# Altium project Low_Level_ECU.PrjPcb (part 5 of 6)

## Sheet 12- BLE and FLASH.SchDoc: BLE AND SDCARD
size 420 x 297 mm; Revision: 1.0; SheetNumber: 12; SheetTotal: 13; Project: LOW LEVEL ECU
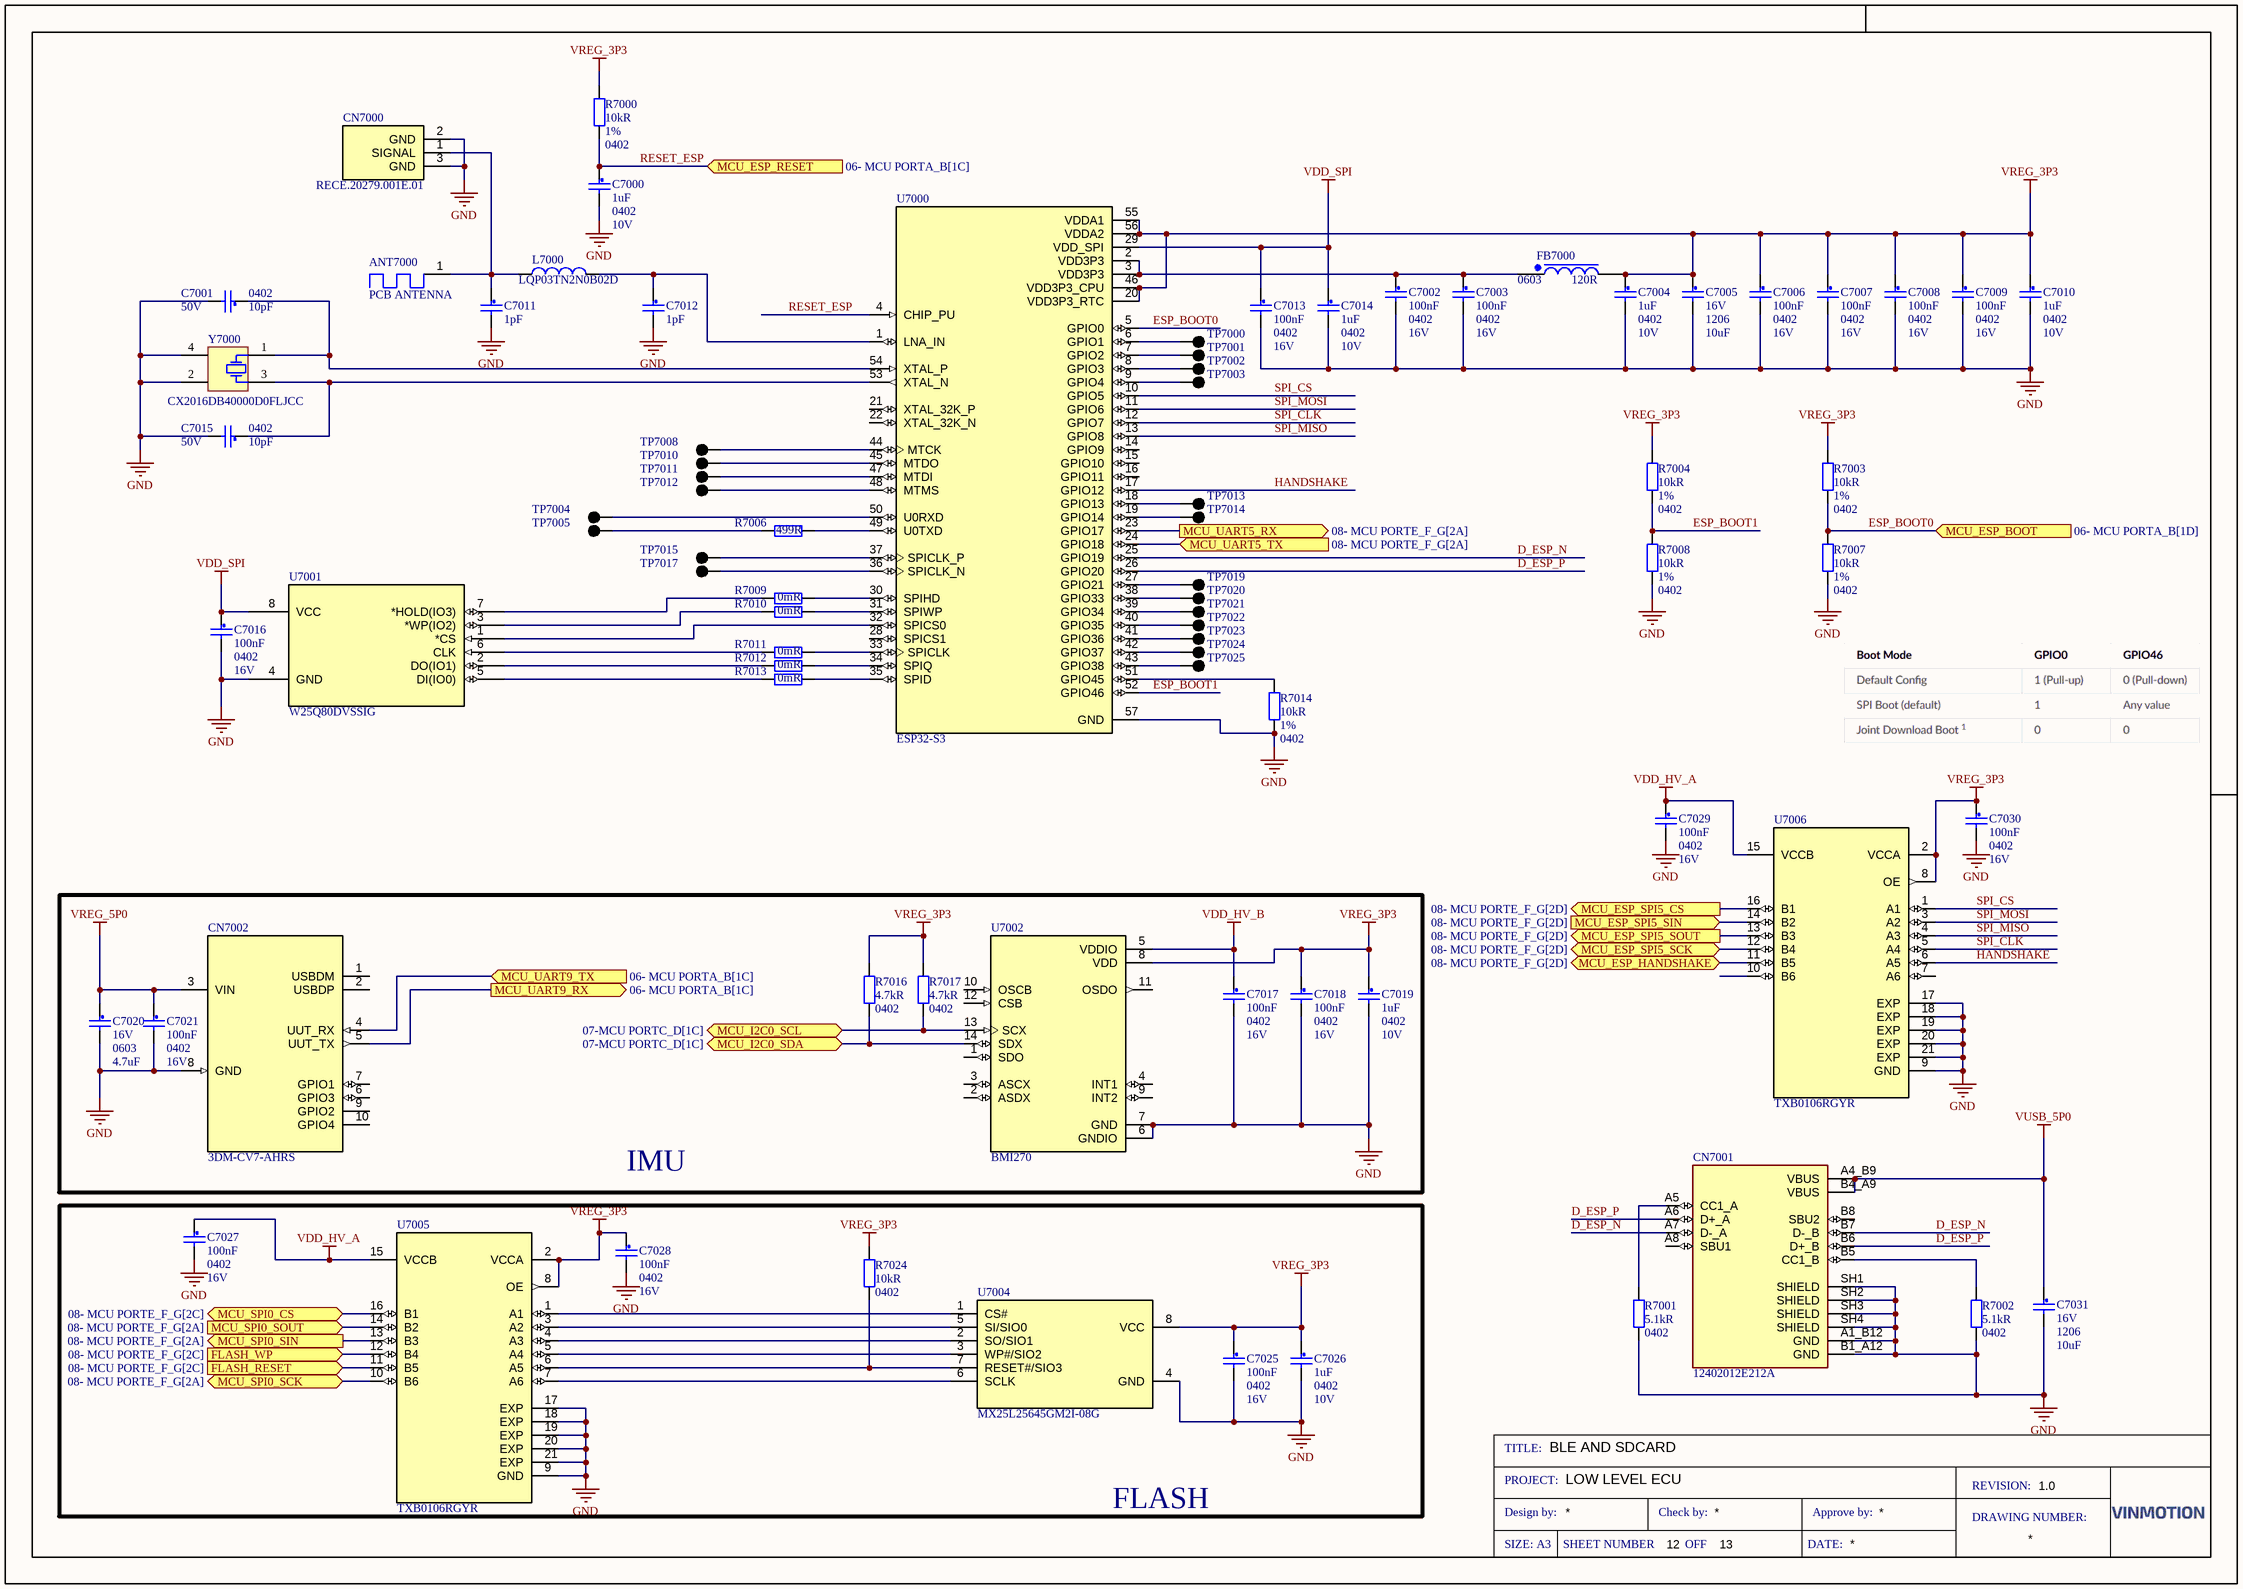
[diagram p10: 12- BLE and FLASH.SchDoc]

### Parts
ANT7000  PCB ANTENNA  [ANTENNA 2.4G]
C7000  value 1uF  Case/Package: 0402  Rated DC Voltage (URdc): 10V  [CAP0402]  (hidden comment: CL05X105KP5NNNC)
C7001  Voltage Rating: 50V  Case/Package: 0402  Capacitance: 10pF  [CAP0402]  (hidden comment: UMK105CG100DVHF)
C7002  Capacitance: 100nF  Case/Package: 0402  Voltage Rating (DC): 16V  [CAP0402]  (hidden comment: 0402YC104KAT2A)
C7003  Capacitance: 100nF  Case/Package: 0402  Voltage Rating (DC): 16V  [CAP0402]  (hidden comment: 0402YC104KAT2A)
C7004  value 1uF  Case/Package: 0402  Rated DC Voltage (URdc): 10V  [CAP0402]  (hidden comment: CL05X105KP5NNNC)
C7005  Voltage Rating: 16V  Case/Package: 1206  Capacitance: 10uF  [CAP1206]  (hidden comment: CL31B106KOHVPNE)
C7006  Capacitance: 100nF  Case/Package: 0402  Voltage Rating (DC): 16V  [CAP0402]  (hidden comment: 0402YC104KAT2A)
C7007  Capacitance: 100nF  Case/Package: 0402  Voltage Rating (DC): 16V  [CAP0402]  (hidden comment: 0402YC104KAT2A)
C7008  Capacitance: 100nF  Case/Package: 0402  Voltage Rating (DC): 16V  [CAP0402]  (hidden comment: 0402YC104KAT2A)
C7009  Capacitance: 100nF  Case/Package: 0402  Voltage Rating (DC): 16V  [CAP0402]  (hidden comment: 0402YC104KAT2A)
C7010  value 1uF  Case/Package: 0402  Rated DC Voltage (URdc): 10V  [CAP0402]  (hidden comment: CL05X105KP5NNNC)
C7011  value 1pF  [CAP0201]  (hidden comment: GRM0335C1H1R0BA01D)
C7012  value 1pF  [CAP0201]  (hidden comment: GRM0335C1H1R0BA01D)
C7013  Capacitance: 100nF  Case/Package: 0402  Voltage Rating (DC): 16V  [CAP0402]  (hidden comment: 0402YC104KAT2A)
C7014  value 1uF  Case/Package: 0402  Rated DC Voltage (URdc): 10V  [CAP0402]  (hidden comment: CL05X105KP5NNNC)
C7015  Voltage Rating: 50V  Case/Package: 0402  Capacitance: 10pF  [CAP0402]  (hidden comment: UMK105CG100DVHF)
C7016  Capacitance: 100nF  Case/Package: 0402  Voltage Rating (DC): 16V  [CAP0402]  (hidden comment: 0402YC104KAT2A)
C7017  Capacitance: 100nF  Case/Package: 0402  Voltage Rating (DC): 16V  [CAP0402]  (hidden comment: 0402YC104KAT2A)
C7018  Capacitance: 100nF  Case/Package: 0402  Voltage Rating (DC): 16V  [CAP0402]  (hidden comment: 0402YC104KAT2A)
C7019  value 1uF  Case/Package: 0402  Rated DC Voltage (URdc): 10V  [CAP0402]  (hidden comment: CL05X105KP5NNNC)
C7020  Voltage Rating: 16V  Case/Package: 0603  Capacitance: 4.7uF  [CAP0603]  (hidden comment: GRT188C81C475KE13D)
C7021  Capacitance: 100nF  Case/Package: 0402  Voltage Rating (DC): 16V  [CAP0402]  (hidden comment: 0402YC104KAT2A)
C7025  Capacitance: 100nF  Case/Package: 0402  Voltage Rating (DC): 16V  [CAP0402]  (hidden comment: 0402YC104KAT2A)
C7026  value 1uF  Case/Package: 0402  Rated DC Voltage (URdc): 10V  [CAP0402]  (hidden comment: CL05X105KP5NNNC)
C7027  Capacitance: 100nF  Case/Package: 0402  Voltage Rating (DC): 16V  [CAP0402]  (hidden comment: 0402YC104KAT2A)
C7028  Capacitance: 100nF  Case/Package: 0402  Voltage Rating (DC): 16V  [CAP0402]  (hidden comment: 0402YC104KAT2A)
C7029  Capacitance: 100nF  Case/Package: 0402  Voltage Rating (DC): 16V  [CAP0402]  (hidden comment: 0402YC104KAT2A)
C7030  Capacitance: 100nF  Case/Package: 0402  Voltage Rating (DC): 16V  [CAP0402]  (hidden comment: 0402YC104KAT2A)
C7031  Voltage Rating: 16V  Case/Package: 1206  Capacitance: 10uF  [CAP0603]  (hidden comment: CL31B106KOHVPNE)
CN7000  RECE.20279.001E.01  [IPEX CONNECTOR]
CN7001  12402012E212A  [USB_TYPE_C]
CN7002  3DM-CV7-AHRS  [3DM-CV7-AHRS]
FB7000  Case/Package: 0603  Impedance: 120R  [FB0603]  (hidden comment: BLM18KG121TH1D)
L7000  LQP03TN2N0B02D  [IND0201]
R7000  value 10kR  Tolerance: 1%  Case/Package: 0402  [RES0402]  (hidden comment: RMCF0402FT10K0)
R7001  Resistance: 5.1kR  Case/Package: 0402  [RES0402]  (hidden comment: MCR01MZPF5101)
R7002  Resistance: 5.1kR  Case/Package: 0402  [RES0402]  (hidden comment: MCR01MZPF5101)
R7003  value 10kR  Tolerance: 1%  Case/Package: 0402  [RES0402]  (hidden comment: RMCF0402FT10K0)
R7004  value 10kR  Tolerance: 1%  Case/Package: 0402  [RES0402]  (hidden comment: RMCF0402FT10K0)
R7006  value 499R  [RES0402]  (hidden comment: CRCW0402499RFKED)
R7007  value 10kR  Tolerance: 1%  Case/Package: 0402  [RES0402]  (hidden comment: RMCF0402FT10K0)
R7008  value 10kR  Tolerance: 1%  Case/Package: 0402  [RES0402]  (hidden comment: RMCF0402FT10K0)
R7009  Resistance: 0mR  [RES0402]  (hidden comment: RMCF0402ZT0R00)
R7010  Resistance: 0mR  [RES0402]  (hidden comment: RMCF0402ZT0R00)
R7011  Resistance: 0mR  [RES0402]  (hidden comment: RMCF0402ZT0R00)
R7012  Resistance: 0mR  [RES0402]  (hidden comment: RMCF0402ZT0R00)
R7013  Resistance: 0mR  [RES0402]  (hidden comment: RMCF0402ZT0R00)
R7014  value 10kR  Tolerance: 1%  Case/Package: 0402  [RES0402]  (hidden comment: RMCF0402FT10K0)
R7016  Resistance: 4.7kR  Case/Package: 0402  [RES0402]  (hidden comment: RMCF0402FT4K70)
R7017  Resistance: 4.7kR  Case/Package: 0402  [RES0402]  (hidden comment: RMCF0402FT4K70)
R7024  Resistance: 10kR  Case/Package: 0402  [RES0402]  (hidden comment: ERJ2GEJ103X)
TP7000  TP  [TP-SMD-R1]  (value not drawn)  (no BOM)
TP7001  TP  [TP-SMD-R1]  (value not drawn)  (no BOM)
TP7002  TP  [TP-SMD-R1]  (value not drawn)  (no BOM)
TP7003  TP  [TP-SMD-R1]  (value not drawn)  (no BOM)
TP7004  TP  [TP-SMD-R1]  (value not drawn)  (no BOM)
TP7005  TP  [TP-SMD-R1]  (value not drawn)  (no BOM)
TP7008  TP  [TP-SMD-R1]  (value not drawn)  (no BOM)
TP7010  TP  [TP-SMD-R1]  (value not drawn)  (no BOM)
TP7011  TP  [TP-SMD-R1]  (value not drawn)  (no BOM)
TP7012  TP  [TP-SMD-R1]  (value not drawn)  (no BOM)
TP7013  TP  [TP-SMD-R1]  (value not drawn)  (no BOM)
TP7014  TP  [TP-SMD-R1]  (value not drawn)  (no BOM)
TP7015  TP  [TP-SMD-R1]  (value not drawn)  (no BOM)
TP7017  TP  [TP-SMD-R1]  (value not drawn)  (no BOM)
TP7019  TP  [TP-SMD-R1]  (value not drawn)  (no BOM)
TP7020  TP  [TP-SMD-R1]  (value not drawn)  (no BOM)
TP7021  TP  [TP-SMD-R1]  (value not drawn)  (no BOM)
TP7022  TP  [TP-SMD-R1]  (value not drawn)  (no BOM)
TP7023  TP  [TP-SMD-R1]  (value not drawn)  (no BOM)
TP7024  TP  [TP-SMD-R1]  (value not drawn)  (no BOM)
TP7025  TP  [TP-SMD-R1]  (value not drawn)  (no BOM)
U7000  ESP32-S3  [56-VFQFN Exposed Pad]
U7001  W25Q80DVSSIG  [SOIC127P800X216-8N]
U7002  BMI270  [BIN270]
U7004  MX25L25645GM2I-08G  [SOIC127P800X175-8N]
U7005  TXB0106RGYR  [16-VFQFN Exposed Pad]
U7006  TXB0106RGYR  [16-VFQFN Exposed Pad]
Y7000  CX2016DB40000D0FLJCC  [CRYSTAL2016]

### Blocks framed on the sheet
IMU: C7017-C7021 CN7002 R7016 R7017 U7002
FLASH: C7025-C7028 R7024 U7004 U7005

### Ports
FLASH_RESET (in, see 08- MCU PORTE_F_G[2C]), FLASH_WP (in, see 08- MCU PORTE_F_G[2C]), MCU_ESP_BOOT (in, see 06- MCU PORTA_B[1D]), MCU_ESP_HANDSHAKE (bidir, see 08- MCU PORTE_F_G[2D]), MCU_ESP_RESET (in, see 06- MCU PORTA_B[1C]), MCU_ESP_SPI5_CS (out, see 08- MCU PORTE_F_G[2D]), MCU_ESP_SPI5_SCK (bidir, see 08- MCU PORTE_F_G[2D]), MCU_ESP_SPI5_SIN (in, see 08- MCU PORTE_F_G[2D]), MCU_ESP_SPI5_SOUT (out, see 08- MCU PORTE_F_G[2D]), MCU_I2C0_SCL (bidir, see 07-MCU PORTC_D[1C]), MCU_I2C0_SDA (bidir, see 07-MCU PORTC_D[1C]), MCU_SPI0_CS (bidir, see 08- MCU PORTE_F_G[2C]), MCU_SPI0_SCK (bidir, see 08- MCU PORTE_F_G[2A]), MCU_SPI0_SIN (out, see 08- MCU PORTE_F_G[2A]), MCU_SPI0_SOUT (in, see 08- MCU PORTE_F_G[2A]), MCU_UART5_RX (out, see 08- MCU PORTE_F_G[2A]), MCU_UART5_TX (in, see 08- MCU PORTE_F_G[2A]), MCU_UART9_RX (out, see 06- MCU PORTA_B[1C]), MCU_UART9_TX (in, see 06- MCU PORTA_B[1C])

### Nets
GND: C7000.2 C7001.2 C7002.2 C7003.2 C7004.2 C7005.2 C7006.2 C7007.2 C7008.2 C7009.2 C7010.2 C7011.2 C7012.2 C7013.2 C7014.2 C7015.2 C7016.2 C7017.2 C7018.2 C7019.2 C7020.2 C7021.2 C7025.2 C7026.2 C7027.2 C7028.2 C7029.2 C7030.2 C7031.2 CN7000.2(GND) CN7000.3(GND) CN7001.A1_B12(GND) CN7001.B1_A12(GND) CN7001.SH1(SHIELD) CN7001.SH2(SHIELD) CN7001.SH3(SHIELD) CN7001.SH4(SHIELD) CN7002.8(GND) R7001.1 R7002.1 R7007.1 R7008.1 R7014.1 U7000.57(GND) U7001.4(GND) U7002.6(GNDIO) U7002.7(GND) U7004.4(GND) U7005.9(GND) U7005.17(EXP) U7005.18(EXP) U7005.19(EXP) U7005.20(EXP) U7005.21(EXP) U7006.9(GND) U7006.17(EXP) U7006.18(EXP) U7006.19(EXP) U7006.20(EXP) U7006.21(EXP) Y7000.2(GND) Y7000.4(GND)
VDD_HV_A: C7027.1 C7029.1 U7005.15(VCCB) U7006.15(VCCB)
VDD_HV_B: C7017.1 U7002.5(VDDIO)
VDD_SPI: C7013.1 C7014.1 C7016.1 U7000.29(VDD_SPI) U7001.8(VCC)
VREG_3P3: C7004.1 C7005.1 C7006.1 C7007.1 C7008.1 C7009.1 C7010.1 C7018.1 C7019.1 C7025.1 C7026.1 C7028.1 C7030.1 FB7000.2 R7000.2 R7003.2 R7004.2 R7016.2 R7017.2 R7024.2 U7000.20(VDD3P3_RTC) U7000.46(VDD3P3_CPU) U7000.55(VDDA1) U7000.56(VDDA2) U7002.8(VDD) U7004.8(VCC) U7005.2(VCCA) U7005.8(OE) U7006.2(VCCA) U7006.8(OE)
VREG_5P0: C7020.1 C7021.1 CN7002.3(VIN)
VUSB_5P0: C7031.1 CN7001.A4_B9(VBUS) CN7001.B4_A9(VBUS)
D_ESP_N: CN7001.A7(D-_A) CN7001.B7(D-_B) U7000.25(GPIO19)
D_ESP_P: CN7001.A6(D+_A) CN7001.B6(D+_B) U7000.26(GPIO20)
ESP_BOOT0: R7003.1 R7007.2 U7000.5(GPIO0) ; port MCU_ESP_BOOT
ESP_BOOT1: R7004.1 R7008.2 U7000.52(GPIO46)
HANDSHAKE: U7000.17(GPIO12) U7006.6(A5)
RESET_ESP: C7000.1 R7000.1 U7000.4(CHIP_PU) ; port MCU_ESP_RESET
SPI_CLK: U7000.12(GPIO7) U7006.5(A4)
SPI_CS: U7000.10(GPIO5) U7006.1(A1)
SPI_MISO: U7000.13(GPIO8) U7006.4(A3)
SPI_MOSI: U7000.11(GPIO6) U7006.3(A2)
NetANT7000_1: ANT7000.1(ANT) C7011.1 CN7000.1(SIGNAL) L7000.1
NetC7001_1: C7001.1 U7000.54(XTAL_P) Y7000.1(OSC1)
NetC7002_1: C7002.1 C7003.1 FB7000.1 U7000.2(VDD3P3) U7000.3(VDD3P3)
NetC7012_1: C7012.1 L7000.2 U7000.1(LNA_IN)
NetC7015_1: C7015.1 U7000.53(XTAL_N) Y7000.3(OSC2)
NetCN7001_A5: CN7001.A5(CC1_A) R7001.2
NetCN7001_B5: CN7001.B5(CC1_B) R7002.2
NetCN7002_4: CN7002.4(UUT_RX) ; port MCU_UART9_TX
NetCN7002_5: CN7002.5(UUT_TX) ; port MCU_UART9_RX
NetR7006_1: R7006.1 U7000.49(U0TXD)
NetR7006_2: R7006.2 TP7005.1
NetR7009_1: R7009.1 U7001.7(*HOLD(IO3))
NetR7009_2: R7009.2 U7000.30(SPIHD)
NetR7010_1: R7010.1 U7001.3(*WP(IO2))
NetR7010_2: R7010.2 U7000.31(SPIWP)
NetR7011_1: R7011.1 U7001.6(CLK)
NetR7011_2: R7011.2 U7000.33(SPICLK)
NetR7012_1: R7012.1 U7001.2(DO(IO1))
NetR7012_2: R7012.2 U7000.34(SPIQ)
NetR7013_1: R7013.1 U7001.5(DI(IO0))
NetR7013_2: R7013.2 U7000.35(SPID)
NetR7014_2: R7014.2 U7000.51(GPIO45)
NetR7016_1: R7016.1 U7002.14(SDX) ; port MCU_I2C0_SDA
NetR7017_1: R7017.1 U7002.13(SCX) ; port MCU_I2C0_SCL
NetR7024_1: R7024.1 U7004.7(RESET#/SIO3) U7005.6(A5)
NetTP7000_1: TP7000.1 U7000.6(GPIO1)
NetTP7001_1: TP7001.1 U7000.7(GPIO2)
NetTP7002_1: TP7002.1 U7000.8(GPIO3)
NetTP7003_1: TP7003.1 U7000.9(GPIO4)
NetTP7004_1: TP7004.1 U7000.50(U0RXD)
NetTP7008_1: TP7008.1 U7000.44(MTCK)
NetTP7010_1: TP7010.1 U7000.45(MTDO)
NetTP7011_1: TP7011.1 U7000.47(MTDI)
NetTP7012_1: TP7012.1 U7000.48(MTMS)
NetTP7013_1: TP7013.1 U7000.18(GPIO13)
NetTP7014_1: TP7014.1 U7000.19(GPIO14)
NetTP7015_1: TP7015.1 U7000.37(SPICLK_P)
NetTP7017_1: TP7017.1 U7000.36(SPICLK_N)
NetTP7019_1: TP7019.1 U7000.27(GPIO21)
NetTP7020_1: TP7020.1 U7000.38(GPIO33)
NetTP7021_1: TP7021.1 U7000.39(GPIO34)
NetTP7022_1: TP7022.1 U7000.40(GPIO35)
NetTP7023_1: TP7023.1 U7000.41(GPIO36)
NetTP7024_1: TP7024.1 U7000.42(GPIO37)
NetTP7025_1: TP7025.1 U7000.43(GPIO38)
NetU3000_A5: U7005.10(B6) ; port MCU_SPI0_SCK
NetU3000_B5: U7005.13(B3) ; port MCU_SPI0_SIN
NetU3000_B10: U7005.14(B2) ; port MCU_SPI0_SOUT
NetU3000_E6: U7006.12(B4) ; port MCU_ESP_SPI5_SCK
NetU3000_F5: U7006.13(B3) ; port MCU_ESP_SPI5_SOUT
NetU3000_F10: U7006.11(B5) ; port MCU_ESP_HANDSHAKE
NetU3000_G5: U7006.14(B2) ; port MCU_ESP_SPI5_SIN
NetU3000_H5: U7006.16(B1) ; port MCU_ESP_SPI5_CS
NetU3000_L3: U7000.24(GPIO18) ; port MCU_UART5_TX
NetU3000_L10: U7005.16(B1) ; port MCU_SPI0_CS
NetU3000_N1: U7000.23(GPIO17) ; port MCU_UART5_RX
NetU3000_P13: U7005.11(B5) ; port FLASH_RESET
NetU3000_R12: U7005.12(B4) ; port FLASH_WP
NetU7000_32: U7000.32(SPICS0) U7001.1(*CS)
NetU7004_1: U7004.1(CS#) U7005.1(A1)
NetU7004_2: U7004.2(SO/SIO1) U7005.4(A3)
NetU7004_3: U7004.3(WP#/SIO2) U7005.5(A4)
NetU7004_5: U7004.5(SI/SIO0) U7005.3(A2)
NetU7004_6: U7004.6(SCLK) U7005.7(A6)

Not connected (* = marked no-connect by the designer): CN7001 A8(SBU1) B8(SBU2); CN7002 1(USBDM) 2(USBDP) 6(GPIO3) 7(GPIO1) 9(GPIO2) 10(GPIO4); U7000 14(GPIO9) 15(GPIO10) 16(GPIO11) 21(XTAL_32K_P) 22(XTAL_32K_N) 28(SPICS1); U7002 1(SDO) 2(ASDX) 3(ASCX) 4(INT1) 9(INT2) 10(OSCB) 11(OSDO) 12(CSB); U7006 7(A6) 10(B6)

### Notes on the sheet
- TITLE:
- PROJECT:
- Design by:
- Check by:
- Approve by:
- DRAWING NUMBER:
- REVISION:
- SIZE: A3
- SHEET NUMBER
- OFF
- DATE:

### Library data of the parts
ANT7000 = CMP-01139-1: PCB ANTENNA 2.4G
C7000 C7004 C7010 C7014 C7019 C7026 = CMP-01106-1: CAP CER 1UF 10V X6S 0402; Manufacturer: Samsung; Capacitor Type: Ceramic; Multilayer: Yes; Tolerance  (fill in as +-): 10%; Max Operating Temperature: 105°C; Category: Ceramic Capacitors; Dielectric Material: Ceramic; Height: 0.55mm; JESD-609 Code: e3; Length: 1mm; Manufacturer Part Number: CL05X105KP5NNNC; Min Operating Temperature: -55°C; Mounting Technology: Surface Mount; Pins: 2; Package Shape: Rectangular; Package Style: SMTMeter; Packaging: Tape and Reel; Tolerance (fill in as +-): 10%; Reach SVHC Compliant: Yes; RoHS Compliant: Yes; Temperature Characteristics Code: X6S; Terminal Finish: Nickel; Termination: Wraparound; Width: 0.5mm
C7001 C7015 = CMP-00047-2: CAP CER 10pF 50V NP0 0402; Manufacturer 1: Taiyo Yuden; Mount Type(SMD/TH): SMD; Crossable(YES/NO): YES; Manufacturer Part Number 1: UMK105CG100DVHF; Mount: Surface Mount; Case Code (Metric): 1005; Max Operating Temperature: 125°C; Thickness: 0.022inch; Min Operating Temperature: -55°C; Case Code (Imperial): 0402; Width: 0.02inch; Ratings: AEC-Q200; Length: 0.039inch; Packaging: Tape and Reel; Lead Free: Lead Free; Voltage Rating (DC): 50V; Halogen Free: Halogen Free; Height: 0.5mm
C7002 C7003 C7006-C7009 C7013 C7016-C7018 C7021 C7025 C7027-C7030 = CMP-00988-1: CAP CER 0.1UF 16V X7R 0402; Manufacturer 1: KYOCERA AVX; Crossable(YES/NO): YES; Mount Type(SMD/TH): SMD; Case Code (Imperial): 0402; Case Code (Metric): 1005; Dielectric: X7R; Manufacturer Part Number 1: 0402YC104KAT2A; Max Operating Temperature: 125°C; Min Operating Temperature: -55°C; Mount: Surface Mount; Voltage Rating: 16V
C7005 C7031 = CMP-00045-5: CAP CER 10uF 16V 10% X7R 1206 SMD; Manufacturer 1: Samsung; Crossable(YES/NO): YES; Ratings: AEC-Q200; Packaging: Tape and Reel; Thickness: 0.071inch; Min Operating Temperature: -55°C; Case Code (Metric): 3216; Max Operating Temperature: 125°C; Mount: Surface Mount; Length: 0.126inch; Dielectric: X7R; Tolerance: 10%; Width: 0.063inch; Case Code (Imperial): 1206; Manufacturer Part Number 1: CL31B106KOHVPNE; Features: Soft Termination; Mount Type(SMD/TH): SMD; Height: 1.6mm; Lead Free: Lead Free; Voltage Rating (DC): 16V
C7011 C7012 = CMP-01137-1: CAP CER 1PF 50V C0G/NP0 0201; Manufacturer: Murata; Capacitor Type: Ceramic; Multilayer: Yes; Tolerance  (fill in as +-): 10%; Temperature Characteristics Code: C0G; Category: Ceramic Capacitors; Dielectric Material: Ceramic; Height: 0.3mm; JESD-609 Code: e3; Length: 0.6mm; Manufacturer Part Number: GRM0335C1H1R0BA01D; Max Operating Temperature: 125°C; Min Operating Temperature: -55°C; Mounting Technology: Surface Mount; Pins: 2; Package Shape: Rectangular; Package Style: SMTMeter; Packaging: Tape and Reel; Tolerance (fill in as +-): 10%; Rated DC Voltage (URdc): 50V; Reach SVHC Compliant: Yes; RoHS Compliant: Yes; Case/Package: 0201; Terminal Finish: Nickel; Termination: Wraparound; Width: 0.3mm
C7020 = CMP-00351-2: CAP CER 4.7uF 16V 10% X6S 0603 SMD; Manufacturer 1: Murata Electronics; Crossable(YES/NO): YES; Case Code (Imperial): 0603; Tolerance: 10%; Packaging: Tape and Reel; Width: 0.031inch; Case Code (Metric): 1608; Mount Type(SMD/TH): SMD; Min Operating Temperature: -55°C; Max Operating Temperature: 105°C; Mount: Surface Mount; Thickness: 0.035inch; Manufacturer Part Number 1: GRT188C81C475KE13D; Ratings: AEC-Q200; Length: 0.063inch; Height: 0.8mm; Lead Free: Lead Free; Voltage Rating (DC): 16V
CN7000 = CMP-01147-1: CONN UMC RCPT STR 50 OHM SMD; Manufacturer: Taoglas; Dielectric Material: Liquid Crystal Polymer; Frequency: 6GHz; Impedance: 50Ω; Category: RF / Coaxial Connectors; Contact Gender: Male; Manufacturer Part Number: RECE.20279.001E.01; Max Operating Temperature: 90°C; Min Operating Temperature: -40°C; REACH SVHC: Yes; RoHS: Compliant
CN7001 = CMP-01116-1: CONN RCP USB2.0 TYP C 24P SMD RA; Manufacturer: Amphenol; Manufacturer Part Number: 12402012E212A; Category: Connectors
CN7002 = CMP-01131-1: IMUs - Inertial Measurement Units High Performance OEM IMU/AHRS; Manufacturer: LORD; Category: Uncategorized; Manufacturer Part Number: 3DM-CV7-AHRS
FB7000 = CMP-ROOT-0013-6: FERRITE BEAD 120 OHM 0603 1LN; Manufacturer 1: Murata Electronics; Mount Type(SMD/TH): SMD; Max Current Rating: 3A; Number of Circuits: 1; Crossable(YES/NO): YES; DC Resistance (DCR): 30mR; Manufacturer Part Number 1: BLM18KG121TH1D; Height: 0.03inch; Package Quantity: 1; Max Operating Temperature: 125°C; Mount: Surface Mount; Ratings: AEC-Q200; Min Operating Temperature: -55°C; Number of Lines: 1; Length: 0.063inch; Packaging: Tape and Reel; Case Code (Metric): 1608; Width: 0.032inch; Case Code (Imperial): 0603
L7000 = CMP-01138-1: FIXED IND 2NH 600MA 150 MOHM SMD; Manufacturer: Murata; Case/Size Code: 0201; DC Resistance (DCR): 150mR; Inductance-Nom (L): 0.002uH; Inductor Application: RF INDUCTOR; Inductor Type: GENERAL PURPOSE INDUCTOR; Channels: 1; Package Height: 0.3mm; Package Length: 0.6mm; Quality Factor-Min (at L-nom): 14; Self Resonant Frequency: 12.5GHz; Shape/Size Description: RECTANGULAR PACKAGE; Shielding: Unshielded; Test Frequency: 500MHz; Tolerance: 5%; Construction: Chip; Category: Fixed Inductors; JESD-609 Code: e3; Manufacturer Part Number: LQP03TN2N0B02D; Max Operating Temperature: 125°C; Min Operating Temperature: -55°C; Pins: 2; Package Style: SMTMeter; Package Width: 0.3mm; Packaging: Tape and Reel; Max Current Rating: 600mA; Reach SVHC Compliant: Yes; RoHS Compliant: Yes; Surface Mount: Yes; Terminal Finish: Tin; Terminal Placement: Dual Ended; Termination: Wraparound
R7000 R7003 R7004 R7007 R7008 R7014 = CMP-01105-1: RES 10K OHM 1% 1/16W 0402; Manufacturer: Stackpole Electronics; Package Length: 1mm; Package Height: 0.3mm; Package Width: 0.5mm; Power: 63mW; Rated Temperature: 70°C; Reference Standard: AEC-Q200; Temperature Coefficient (ppm/Cel): 100; Working Voltage: 50V; Category: Chip SMD Resistors; Construction: Rectangular; JESD-609 Code: e3; Manufacturer Part Number: RMCF0402FT10K0; Max Operating Temperature: 155°C; Min Operating Temperature: -55°C; Mounting Technology: Surface Mount; Pins: 2; Package Shape: Rectangular; Packaging: Tape and Reel; Reach SVHC Compliant: Yes; Resistor Type: FIXED RESISTOR; RoHS Compliant: Yes; Technology: METAL GLAZE/THICK FILM; Terminal Finish: Nickel; Termination: Wraparound
R7001 R7002 = CMP-00289-1: RES SMD 5.1K OHM 1% 1/16W 0402; Manufacturer 1: Rohm Semiconductor; Crossable(YES/NO): YES; Max Power Dissipation: 63mW; Voltage Rating (DC): 50V; Temperature Coefficient: 400ppm/°C; Width: 0.02inch; Number of Terminations: 2; Min Operating Temperature: -55°C; Mount Type(SMD/TH): SMD; Case Code (Metric): 1005; Depth: 0.5mm; Max Operating Temperature: 155°C; Composition: Thick Film; Features: Automotive AEC-Q200; Height: 0.016inch; Packaging: Tape and Reel; Package Quantity: 10000; Length: 0.039inch; Tolerance: 1%; Lead Free: Lead Free; Case Code (Imperial): 0402; Manufacturer Part Number 1: MCR01MZPF5101; Military Standard: Not
R7006 = CMP-01135-1: RES SMD 499 OHM 1% 1/16W 0402; Manufacturer: Vishay; Package Height: 0.35mm; Package Length: 1mm; Package Width: 0.5mm; Power: 63mW; Rated Temperature: 70°C; Reference Standard: AEC-Q200; Temperature Coefficient (ppm/Cel): 100; Working Voltage: 50V; Category: Chip SMD Resistors; Construction: Chip; JESD-609 Code: e3; Manufacturer Part Number: CRCW0402499RFKED; Max Operating Temperature: 155°C; Min Operating Temperature: -55°C; Mounting Technology: Surface Mount; Pins: 2; Package Shape: Rectangular; Packaging: Tape and Reel; Reach SVHC Compliant: Yes; Resistor Type: FIXED RESISTOR; RoHS Compliant: Yes; Case/Package: 0402; Technology: METAL GLAZE/THICK FILM; Terminal Finish: Nickel; Termination: Wraparound; Tolerance: 1%
R7009-R7013 = CMP-ROOT-0037-10: RES 0R 1/16W 1% 0402 SMD; Manufacturer 1: Stackpole Electronics Inc; Max Power Dissipation: 63mW; Crossable(YES/NO): YES; Current Rating: 1A; Working Voltage: 50V; Height: 0.016inch; Radiation Hardening: No; Max Operating Temperature: 155°C; Min Operating Temperature: -55°C; Lead Free: Lead Free; Contact Plating: Tin,Matte; Number of Terminations: 2; Features: Automotive AEC-Q200; Case Code (Metric): 1005; Mount: Surface Mount; Packaging: Tape and Reel; Width: 0.02inch; Mount Type(SMD/TH): SMD; Length: 0.039inch; Depth: 0.5mm; Composition: Thick Film; Power Rating: 63mW; Military Standard: Not; Case Code (Imperial): 0402; Manufacturer Part Number 1: RMCF0402ZT0R00; Case/Package: 0402
R7016 R7017 = CMP-00354-2: RES 4.7kR 1/16W 1% 0402 SMD; Manufacturer 1: Stackpole Electronics Inc; Temperature Coefficient: 100ppm/°C; Crossable(YES/NO): YES; Max Power Dissipation: 63mW; Number of Terminations: 2; Case Code (Imperial): 0402; Packaging: Tape and Reel; Case Code (Metric): 1005; Tolerance: 1%; Length: 1mm; Military Standard: Not; Composition: Thick Film; Height: 0.016inch; Mount: Surface Mount; Radiation Hardening: No; Features: Automotive AEC-Q200; Manufacturer Part Number 1: RMCF0402FT4K70; Width: 0.02inch; Mount Type(SMD/TH): SMD; Max Operating Temperature: 155°C; Min Operating Temperature: -55°C; Depth: 0.5mm; Lead Free: Lead Free; Contact Plating: Tin,Matte
R7024 = CMP-00039-6: RES SMD 10K OHM 5% 1/10W 0402; Manufacturer 1: Panasonic Electronic Components; Temperature Coefficient: 200ppm/°C; Max Power Dissipation: 100mW; Crossable(YES/NO): YES; Voltage Rating: 50V; Width: 0.02inch; Tolerance: 5%; Number of Terminations: 2; Max Operating Temperature: 155°C; Case Code (Imperial): 0402; Military Standard: Not; Lead Free: Lead Free; Length: 1mm; Manufacturer Part Number 1: ERJ2GEJ103X; Composition: Thick Film; Mount: Surface Mount; REACH SVHC: No SVHC; Mount Type(SMD/TH): SMD; Power Rating: 100mW; Radiation Hardening: No; Package Quantity: 1; Features: Automotive AEC-Q200; Case Code (Metric): 1005; Voltage Rating (DC): 50V; Termination: SMD/SMT; Contact Plating: Tin; Height: 0.35mm; Depth: 0.5mm; Min Operating Temperature: -55°C; Packaging: Cut Tape
TP7000-TP7005 TP7008 TP7010-TP7015 TP7017 TP7019-TP7025 = CMP-ROOT-0080-12: Test Point 1x1mm; Manufacturer Part Number 1: NA; Mount Type(SMD/TH): TH; Crossable(YES/NO): YES; Manufacturer 1: N/A
U7000 = CMP-01132-1: IC RF TXRX+MCU BLE 56QFN; Manufacturer: Espressif Systems; Manufacturer Part Number: ESP32-S3R8; Category: RF Receivers, Transceivers
U7001 = CMP-01134-1: IC FLASH 8MBIT SPI/QUAD 8SOIC; Manufacturer: Winbond; Endurance: 100000Cycles; Clock Frequency: 104MHz; Data Retention Time-Min: 20; Density: 8388608b; Max Supply Current: 25uA; Memory Width: 1; Memory Size: 8388608; Number of Words Code: 8M; Operating Mode: SYNCHRONOUS; Organization: 8MX1; Package Body Material: Plastic; Package Equivalence Code: SOP8,.3; Parallel/Serial: SERIAL; Power Supplies: 3/3.3V; Programming Voltage: 3V; Qualification Status: Not Qualified; Serial Bus Type: SPI; Standby Current-Max: 5uA; Max Supply Voltage: 3.6V; Min Supply Voltage: 2.7V; Write Protection: HARDWARE/SOFTWARE; Category: Flash; Height - Seated (Max): 2.16mm; JESD-30 Code: S-PDSO-G8; Length: 5.23mm; Manufacturer Part Number: W25Q80DVSSIG; Max Operating Temperature: 85°C; Memory Format: FLASH; Min Operating Temperature: -40°C; Channels: 1; Pins: 8; Case/Package: SOP; Package Shape: Square; Package Style: SMALL OUTLINEMeter; Reach SVHC Compliant: Yes; RoHS Compliant: Yes; Nominal Supply Voltage: 3V; Surface Mount: Yes; Technology: CMOS; Temperature Grade: INDUSTRIAL; Terminal Form: Gull Wing; Terminal Pitch: 1.27mm; Terminal Position: DUAL; Type: NOR TYPE; Width: 5.23mm
U7002 = CMP-01130-1: IMU ACCEL/GYRO I2C/SPI 14LGA; Manufacturer: Bosch Sensortec; Manufacturer Part Number: BMI270; Category: LDO
U7004 = CMP-01188-1: IC FLASH 256MBIT SPI 120MHZ 8SOP; Manufacturer: Macronix; Interface: Serial; Max Supply Current: 25mA; Max Supply Voltage: 3.6V; Memory Size: 32MB; Min Supply Voltage: 2.7V; Number of Circuits: 1; Operating Supply Voltage: 3V; Height - Seated (Max): 2.16mm; Category: Flash; Clock Rate: 120MHz; Length: 5.28mm; Lifecycle Status: Production; Manufacturer Part Number: MX25L25645GM2I-08G; Max Operating Temperature: 85°C; Memory Format: FLASH; Min Operating Temperature: -40°C; Number of Terminals: 8; REACH SVHC: Yes; RoHS: Compliant; Schedule B: 8542320070, 8542320070|8542320070|8542320070|8542320070|8542320070; Terminal Pitch: 1.27mm; Width: 5.23mm
U7005 U7006 = CMP-01197-1: IC VOLTAGE LEVEL BIDIR 16-VQFN; Manufacturer: Texas Instruments; Manufacturer Lifecycle Status: ACTIVE; Data Rate: 100Mbps; High Level Output Current: -20µA; Logic Function: Translator; Low Level Output Current: 20µA; Max Junction Temperature (Tj): 150°C; Max Supply Voltage: 5.5V; Min Supply Voltage: 1.2V; Number of Bits: 6; Number of Circuits: 1; Propagation Delay: 4ns; Quiescent Current: 3.5µA; Turn-On Delay Time: 9.5ns; Category: Voltage Level Shifters; Ambient Temperature Range High: 85°C; Case/Package: VQFN; Contact Plating: Gold; Height: 1mm; Lead Free: Lead Free; Length: 4mm; Lifecycle Status: Production; Manufacturer Part Number: TXB0106RGYR; Max Operating Temperature: 85°C; Min Operating Temperature: -40°C; Mounting Technology: Surface Mount; Number of Channels: 6; Number of Inputs: 6; Number of Outputs: 6; Pins: 16; Radiation Hardening: No; REACH SVHC: No; RoHS: Compliant; Schedule B: 8542390000, 8542390000|8542390000|8542390000|8542390000|8542390000; Thickness: 900µm; Weight: 37.194574mg; Width: 3.5mm
Y7000 = CMP-01136-1: CRYSTAL 40.0000MHZ 8PF SMD; Manufacturer: Kyocera AVX; Manufacturer Part Number: CX2016DB40000D0FLJCC; Category: Crystals